# EAGLE design ChainableScrew595 (EAGLE 5.11)
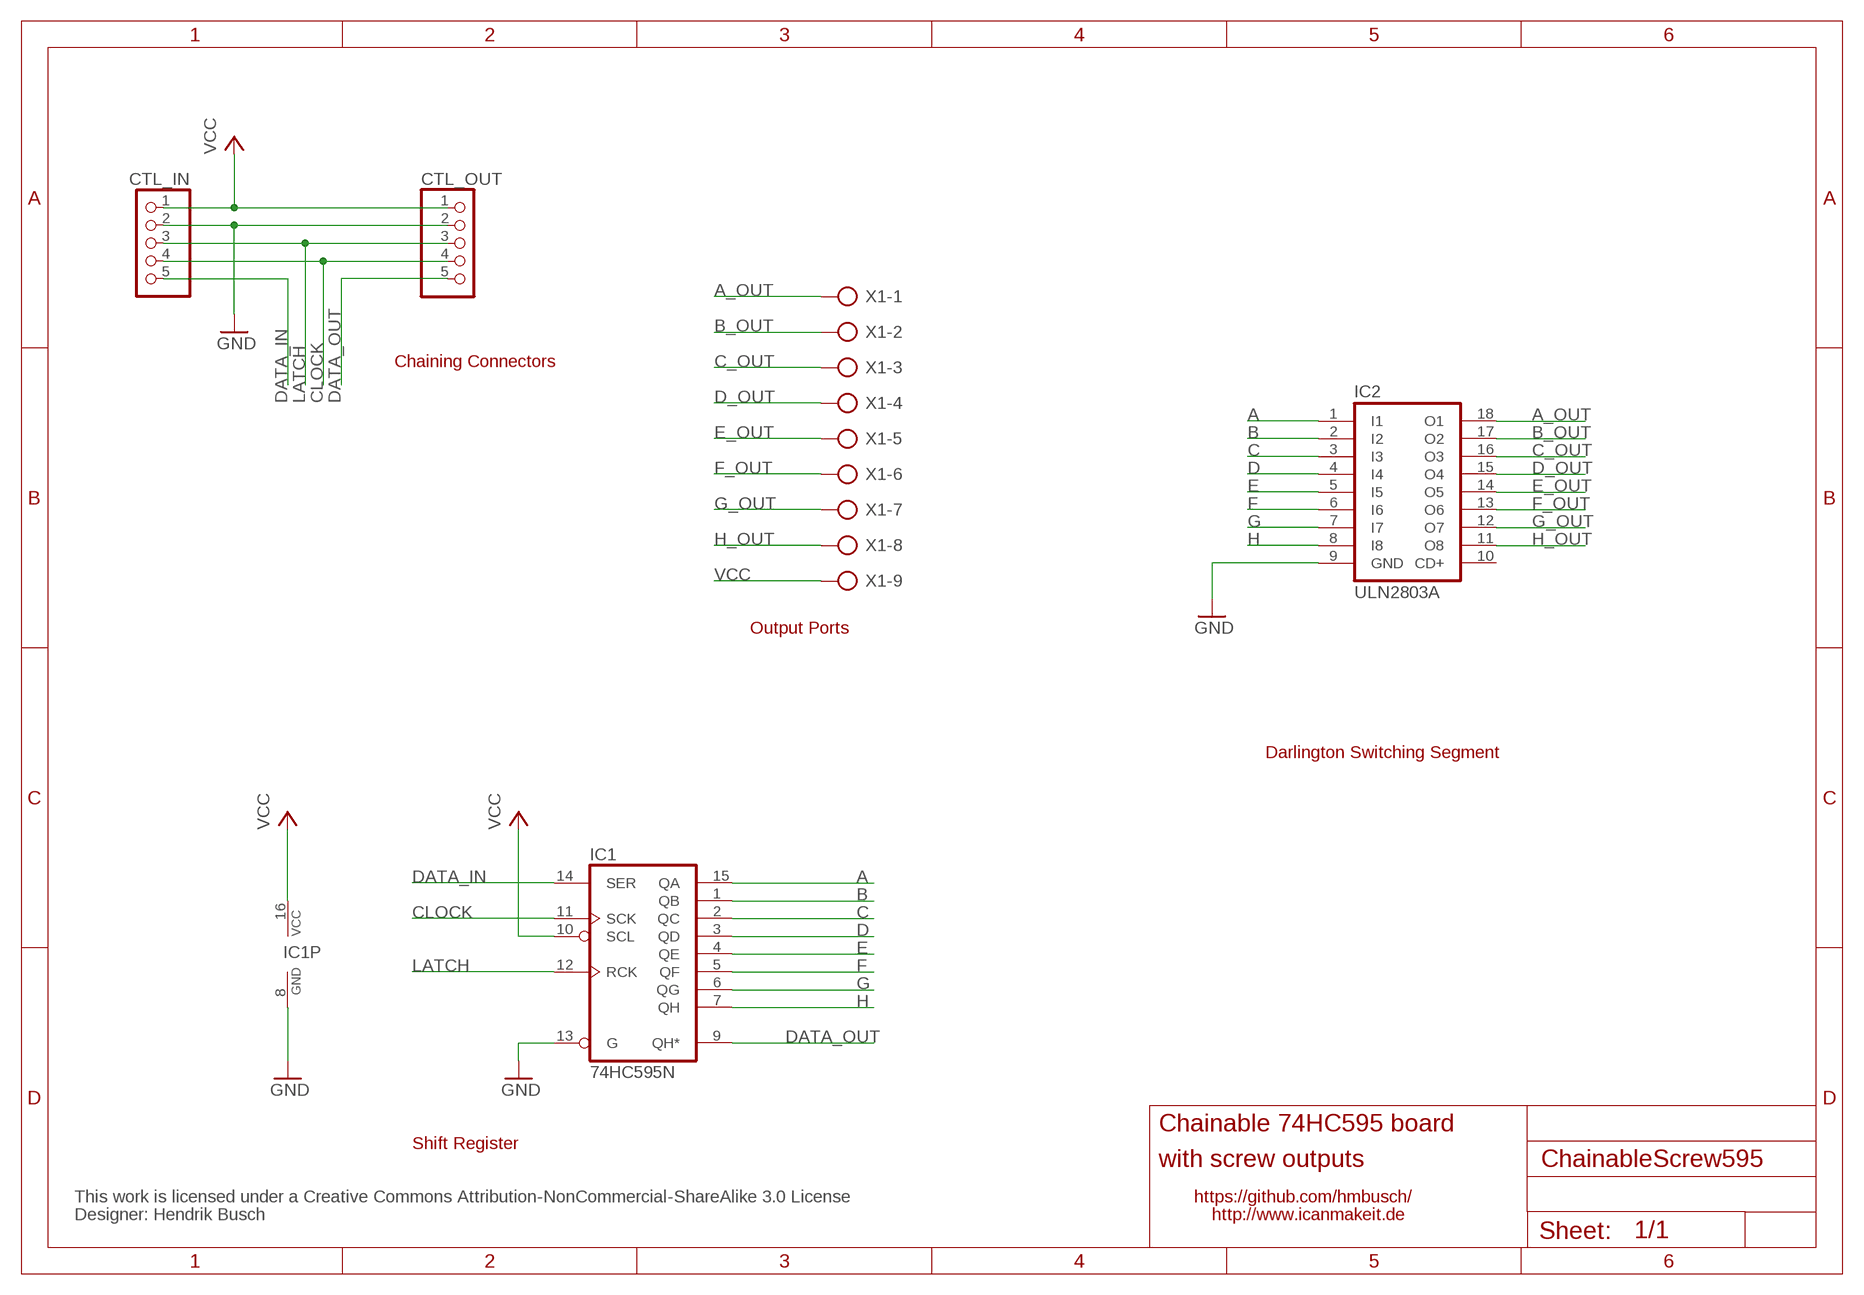
[diagram p0: schematic, sheet 1]

## Parts
CTL_IN  PINHD-1X5  [1X05]
CTL_OUT  PINHD-1X5  [1X05]
IC1  74HC595N  [DIL16]
IC2  ULN2803A  [DIL18]
X1  AK500/9  [AK500/9]

## Nets
A: IC1.15(QA) IC2.1(I1)
A_OUT: IC2.18(O1) X1.1
B: IC1.1(QB) IC2.2(I2)
B_OUT: IC2.17(O2) X1.2
C: IC1.2(QC) IC2.3(I3)
C_OUT: IC2.16(O3) X1.3
CLOCK: CTL_IN.4 CTL_OUT.4 IC1.11(SCK)
D: IC1.3(QD) IC2.4(I4)
D_OUT: IC2.15(O4) X1.4
DATA_IN: CTL_IN.5 IC1.14(SER)
DATA_OUT: CTL_OUT.5 IC1.9(QH*)
E: IC1.4(QE) IC2.5(I5)
E_OUT: IC2.14(O5) X1.5
F: IC1.5(QF) IC2.6(I6)
F_OUT: IC2.13(O6) X1.6
G: IC1.6(QG) IC2.7(I7)
G_OUT: IC2.12(O7) X1.7
GND: CTL_IN.2 CTL_OUT.2 IC1.8(GND) IC1.13(G) IC2.9(GND)
H: IC1.7(QH) IC2.8(I8)
H_OUT: IC2.11(O8) X1.8
LATCH: CTL_IN.3 CTL_OUT.3 IC1.12(RCK)
VCC: CTL_IN.1 CTL_OUT.1 IC1.10(SCL) IC1.16(VCC) X1.9
Unconnected: IC2.10(CD+)

## Notes on the sheet
- Chaining Connectors
- Output Ports
- Darlington Switching Segment
- Chainable 74HC595 board
- Shift Register
- with screw outputs
- This work is licensed under a Creative Commons Attribution-NonCommercial-ShareAlike 3.0 License | https://github.com/hmbusch/
- Designer: Hendrik Busch | http://www.icanmakeit.de

## Library data of the parts
CTL_IN CTL_OUT = pinhead:PINHD-1X5: PIN HEADER
IC1 = 74xx-eu:74*595: 8-bit SHIFT REGISTER, output latch
IC2 = uln-udn:ULN2803A: DRIVER ARRAY
X1 = con-ptr500:AK500/9: CONNECTOR; OC_FARNELL: unknown; OC_NEWARK: unknown

## Board
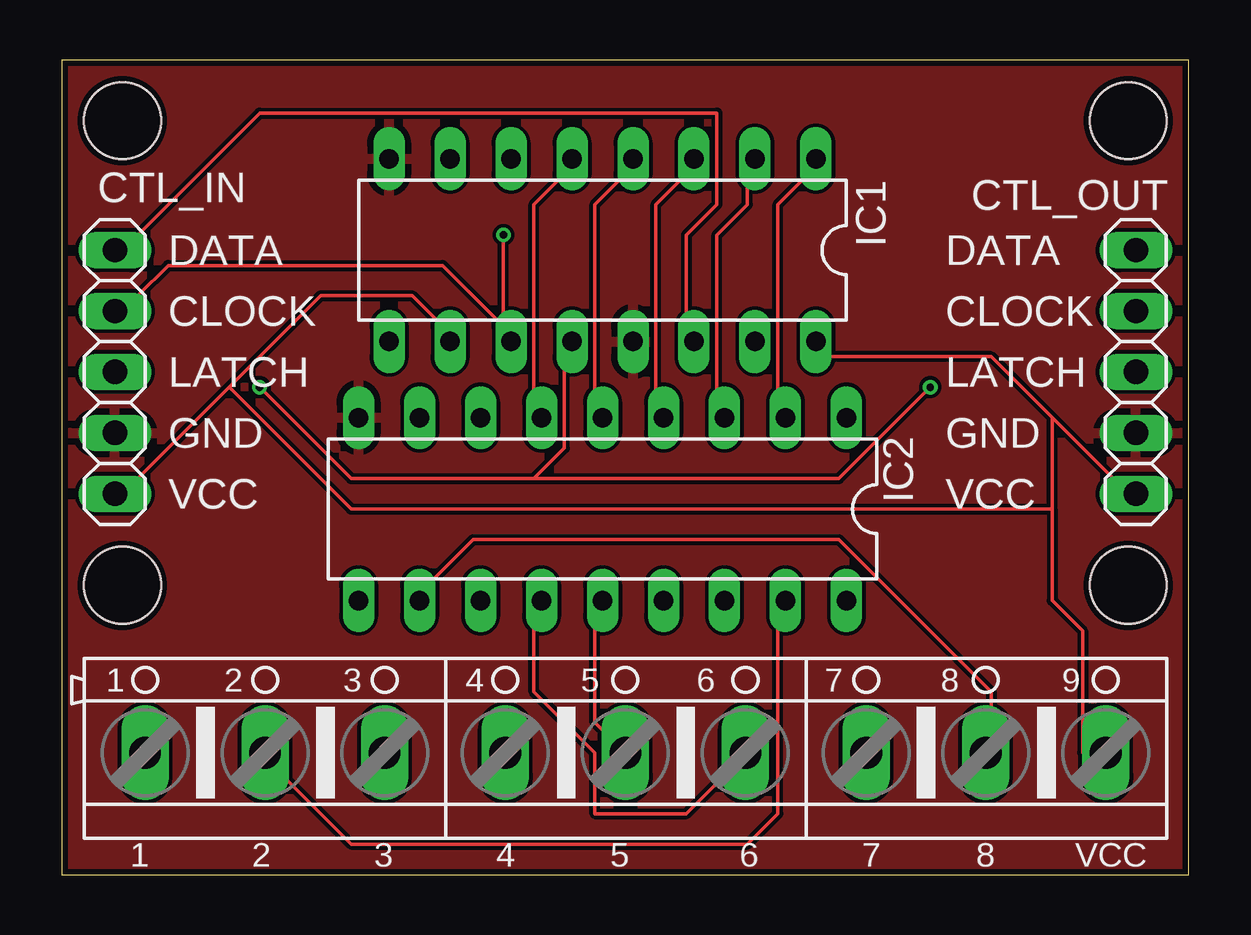
[diagram p1: board, top side]
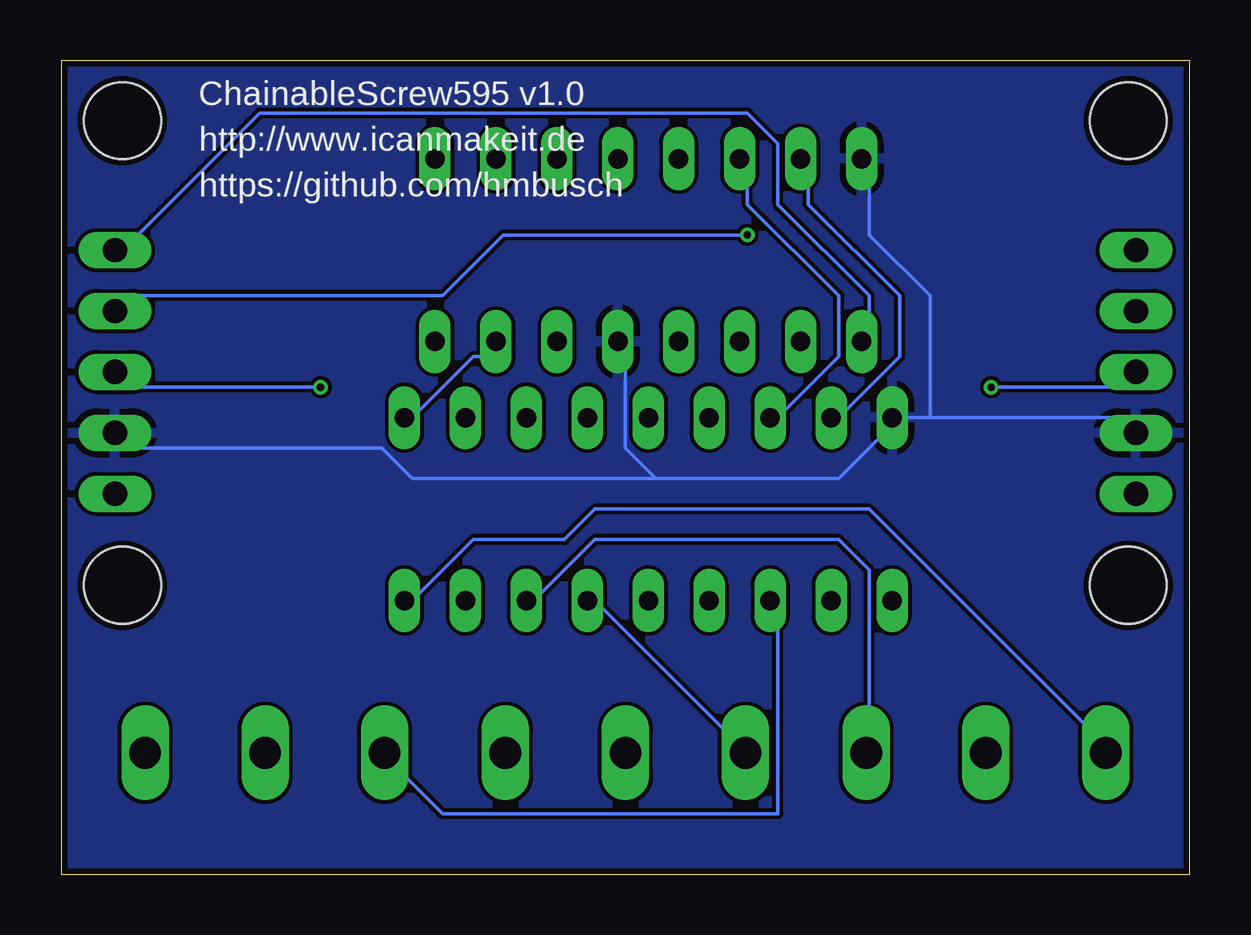
[diagram p2: board, bottom side, seen from below]

Size 46.98 x 33.96 mm. Coordinates in mm from the lower left corner, seen from the top.
Outline: 0,0 46.98,0 46.98,33.96 0,33.96 0,0
Copper layers (1*16): Top 0.035mm / dielectric 1.5mm / Bottom 0.035mm
Design rules "Fusion_eagle_rule_v1.1": minimum track width 6mil, minimum drill 12mil, track to track 6mil, track to pad 6mil, pad to pad 6mil, via to via 6mil, smd to smd 0mil, copper to edge 10mil, drill to drill 10mil, minimum pad ring 10mil, minimum via ring 6mil, stop-mask expansion 2mil, vias tented up to drill 100mil, thermal gap 10mil
Holes 3.2 mm at 2.54,31.43 2.54,12.06 44.45,31.43 44.45,12.06

### Footprints (pad centres in the part's own frame; a part is rotated, then mirrored left to right if it is on the bottom)
1X05 = drill 1.016 long: 1 -5.08,0; 2 -2.54,0; 3 0,0; 4 2.54,0; 5 5.08,0
DIL16 = drill 0.813 long: 1 -8.89,-3.81; 2 -6.35,-3.81; 3 -3.81,-3.81; 4 -1.27,-3.81; 5 1.27,-3.81; 6 3.81,-3.81; 7 6.35,-3.81; 8 8.89,-3.81; 9 8.89,3.81; 10 6.35,3.81; 11 3.81,3.81; 12 1.27,3.81; 13 -1.27,3.81; 14 -3.81,3.81; 15 -6.35,3.81; 16 -8.89,3.81
DIL18 = drill 0.813 long: 1 -10.16,-3.81; 2 -7.62,-3.81; 3 -5.08,-3.81; 4 -2.54,-3.81; 5 0,-3.81; 6 2.54,-3.81; 7 5.08,-3.81; 8 7.62,-3.81; 9 10.16,-3.81; 10 10.16,3.81; 11 7.62,3.81; 12 5.08,3.81; 13 2.54,3.81; 14 0,3.81; 15 -2.54,3.81; 16 -5.08,3.81; 17 -7.62,3.81; 18 -10.16,3.81
AK500/9 = drill 1.321 long: 1 -20.015,0; 2 -15.011,0; 3 -10.033,0; 4 -5.004,0; 5 0,0; 6 5.004,0; 7 10.033,0; 8 15.011,0; 9 20.015,0

### Placement (x,y rotation side)
CTL_IN  2.22,20.95 90 top
CTL_OUT  44.77,20.95 90 top
IC1  22.54,26.04 180 top
IC2  22.54,15.24 180 top
X1  23.49,5.08 0 top

### Tracks (layer width: path | path; a pad name or v marks a point on that pad's centre or on a via)
A
  Bottom 0.152: IC1.15 28.57,21.59 29.84,21.59 32.39,19.05 IC2.1
A_OUT
  Bottom 0.152: IC2.18 32.39,11.43 29.84,13.97 26.04,13.97 24.76,15.24 13.34,15.24 3.17,5.08 X1.1
B
  Top 0.152: IC2.2 29.84,19.05 29.84,27.94 31.11,29.21 IC1.1
B_OUT
  Top 0.152: IC2.17 29.84,11.43 29.84,2.54 28.57,1.27 12.06,1.27 8.26,5.08 X1.2
C
  Top 0.152: IC2.3 27.3,19.05 27.3,26.67 28.57,27.94 28.57,29.21 IC1.2
C_OUT
  Bottom 0.152: IC2.16 27.3,11.43 24.76,13.97 14.61,13.97 13.34,12.7 13.34,5.08 X1.3
CLOCK  (via drill 0.3)
  Top 0.152: 18.41,22.86 15.88,25.4 4.45,25.4 3.17,24.13 CTL_IN.4 | 18.41,22.86 v18.41,26.67 | 18.41,22.86 IC1.11
  Bottom 0.152: v18.41,26.67 28.57,26.67 31.11,24.13 43.82,24.13 CTL_OUT.4
D
  Top 0.152: IC2.4 24.76,19.05 24.76,27.94 26.04,29.21 IC1.3
D_OUT
  Bottom 0.152: IC2.15 24.76,11.43 18.41,5.08 X1.4
DATA_IN
  Top 0.152: IC1.14 26.04,22.86 26.04,26.67 27.3,27.94 27.3,31.75 8.26,31.75 3.17,26.67 CTL_IN.5
DATA_OUT
  Bottom 0.152: IC1.9 13.34,22.86 13.34,24.13 17.14,27.94 17.14,30.48 18.41,31.75 38.73,31.75 43.82,26.67 CTL_OUT.5
E
  Top 0.152: IC2.5 22.22,19.05 22.22,27.94 23.49,29.21 IC1.4
E_OUT
  Top 0.152: X1.5 22.22,6.35 22.22,11.43 IC2.14
F
  Top 0.152: IC2.6 19.68,19.05 19.68,27.94 20.95,29.21 IC1.5
F_OUT
  Top 0.152: IC2.13 19.68,11.43 19.68,7.62 22.22,5.08 22.22,2.54 26.04,2.54 28.57,5.08 X1.6
G
  Bottom 0.152: IC2.7 17.14,19.05 14.61,21.59 14.61,24.13 18.41,27.94 18.41,29.21 IC1.6
G_OUT
  Bottom 0.152: IC2.12 17.14,11.43 17.14,2.54 31.11,2.54 33.66,5.08 X1.7
GND
  Bottom 0.152: 10.79,19.05 3.17,19.05 CTL_IN.2 | 10.79,19.05 12.06,19.05 | 10.79,19.05 10.79,24.13 13.34,26.67 13.34,29.21 IC1.8 | 22.22,16.51 23.49,17.78 23.49,21.59 IC1.13 | 22.22,16.51 14.61,16.51 12.06,19.05 | 12.06,19.05 IC2.9 | 22.22,16.51 32.39,16.51 33.66,17.78 43.82,17.78 CTL_OUT.2
  pour Top: 0,33.97 46.99,33.97 46.99,0 0,0
  pour Bottom: 0,33.97 46.99,33.97 46.99,0 0,0
H
  Bottom 0.152: IC2.8 14.61,19.05 12.06,21.59 12.06,24.13 15.88,27.94 15.88,29.21 IC1.7
H_OUT
  Top 0.152: IC2.11 14.61,11.43 17.14,13.97 32.39,13.97 38.73,7.62 38.73,5.08 X1.8
LATCH  (via drill 0.3)
  Top 0.152: 19.68,16.51 20.95,17.78 20.95,21.59 IC1.12 | 19.68,16.51 12.06,16.51 v8.26,20.32 | v36.2,20.32 32.39,16.51 19.68,16.51
  Bottom 0.152: v8.26,20.32 3.17,20.32 CTL_IN.3 | v36.2,20.32 43.82,20.32 CTL_OUT.3
VCC
  Top 0.152: 6.99,20.32 3.17,16.51 CTL_IN.1 | 6.99,20.32 10.79,24.13 14.61,24.13 15.88,22.86 IC1.10 | 41.27,19.05 43.82,16.51 CTL_OUT.1 | 41.27,19.05 38.73,21.59 31.11,21.59 IC1.16 | 41.27,15.24 41.27,19.05 | 41.27,15.24 41.27,11.43 42.55,10.16 42.55,5.08 X1.9 | 6.99,20.32 12.06,15.24 41.27,15.24

### Text on the board
tNames: DATA | DATA | CLOCK | CLOCK | LATCH | LATCH | GND | GND | VCC | VCC | 1 | 2 | 3 | 4 | 5 | 6 | 7 | 8 | VCC
bNames: ChainableScrew595 v1.0 | http://www.icanmakeit.de | https://github.com/hmbusch